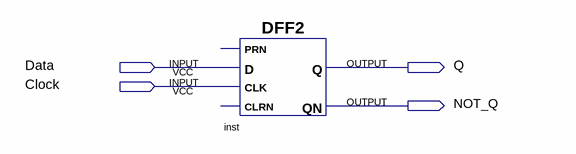
[diagram p0: schematic sheet]
// Quartus schematic DFF_test.bdf as structural Verilog: 1 symbols, 4 pins
module DFF_test (
  input  Data,
  input  Clock,
  output Q,
  output NOT_Q
);

  DFF2 inst (.CLK(Clock), .D(Data), .Q(Q), .QN(NOT_Q));  // open: PRN, CLRN
endmodule
